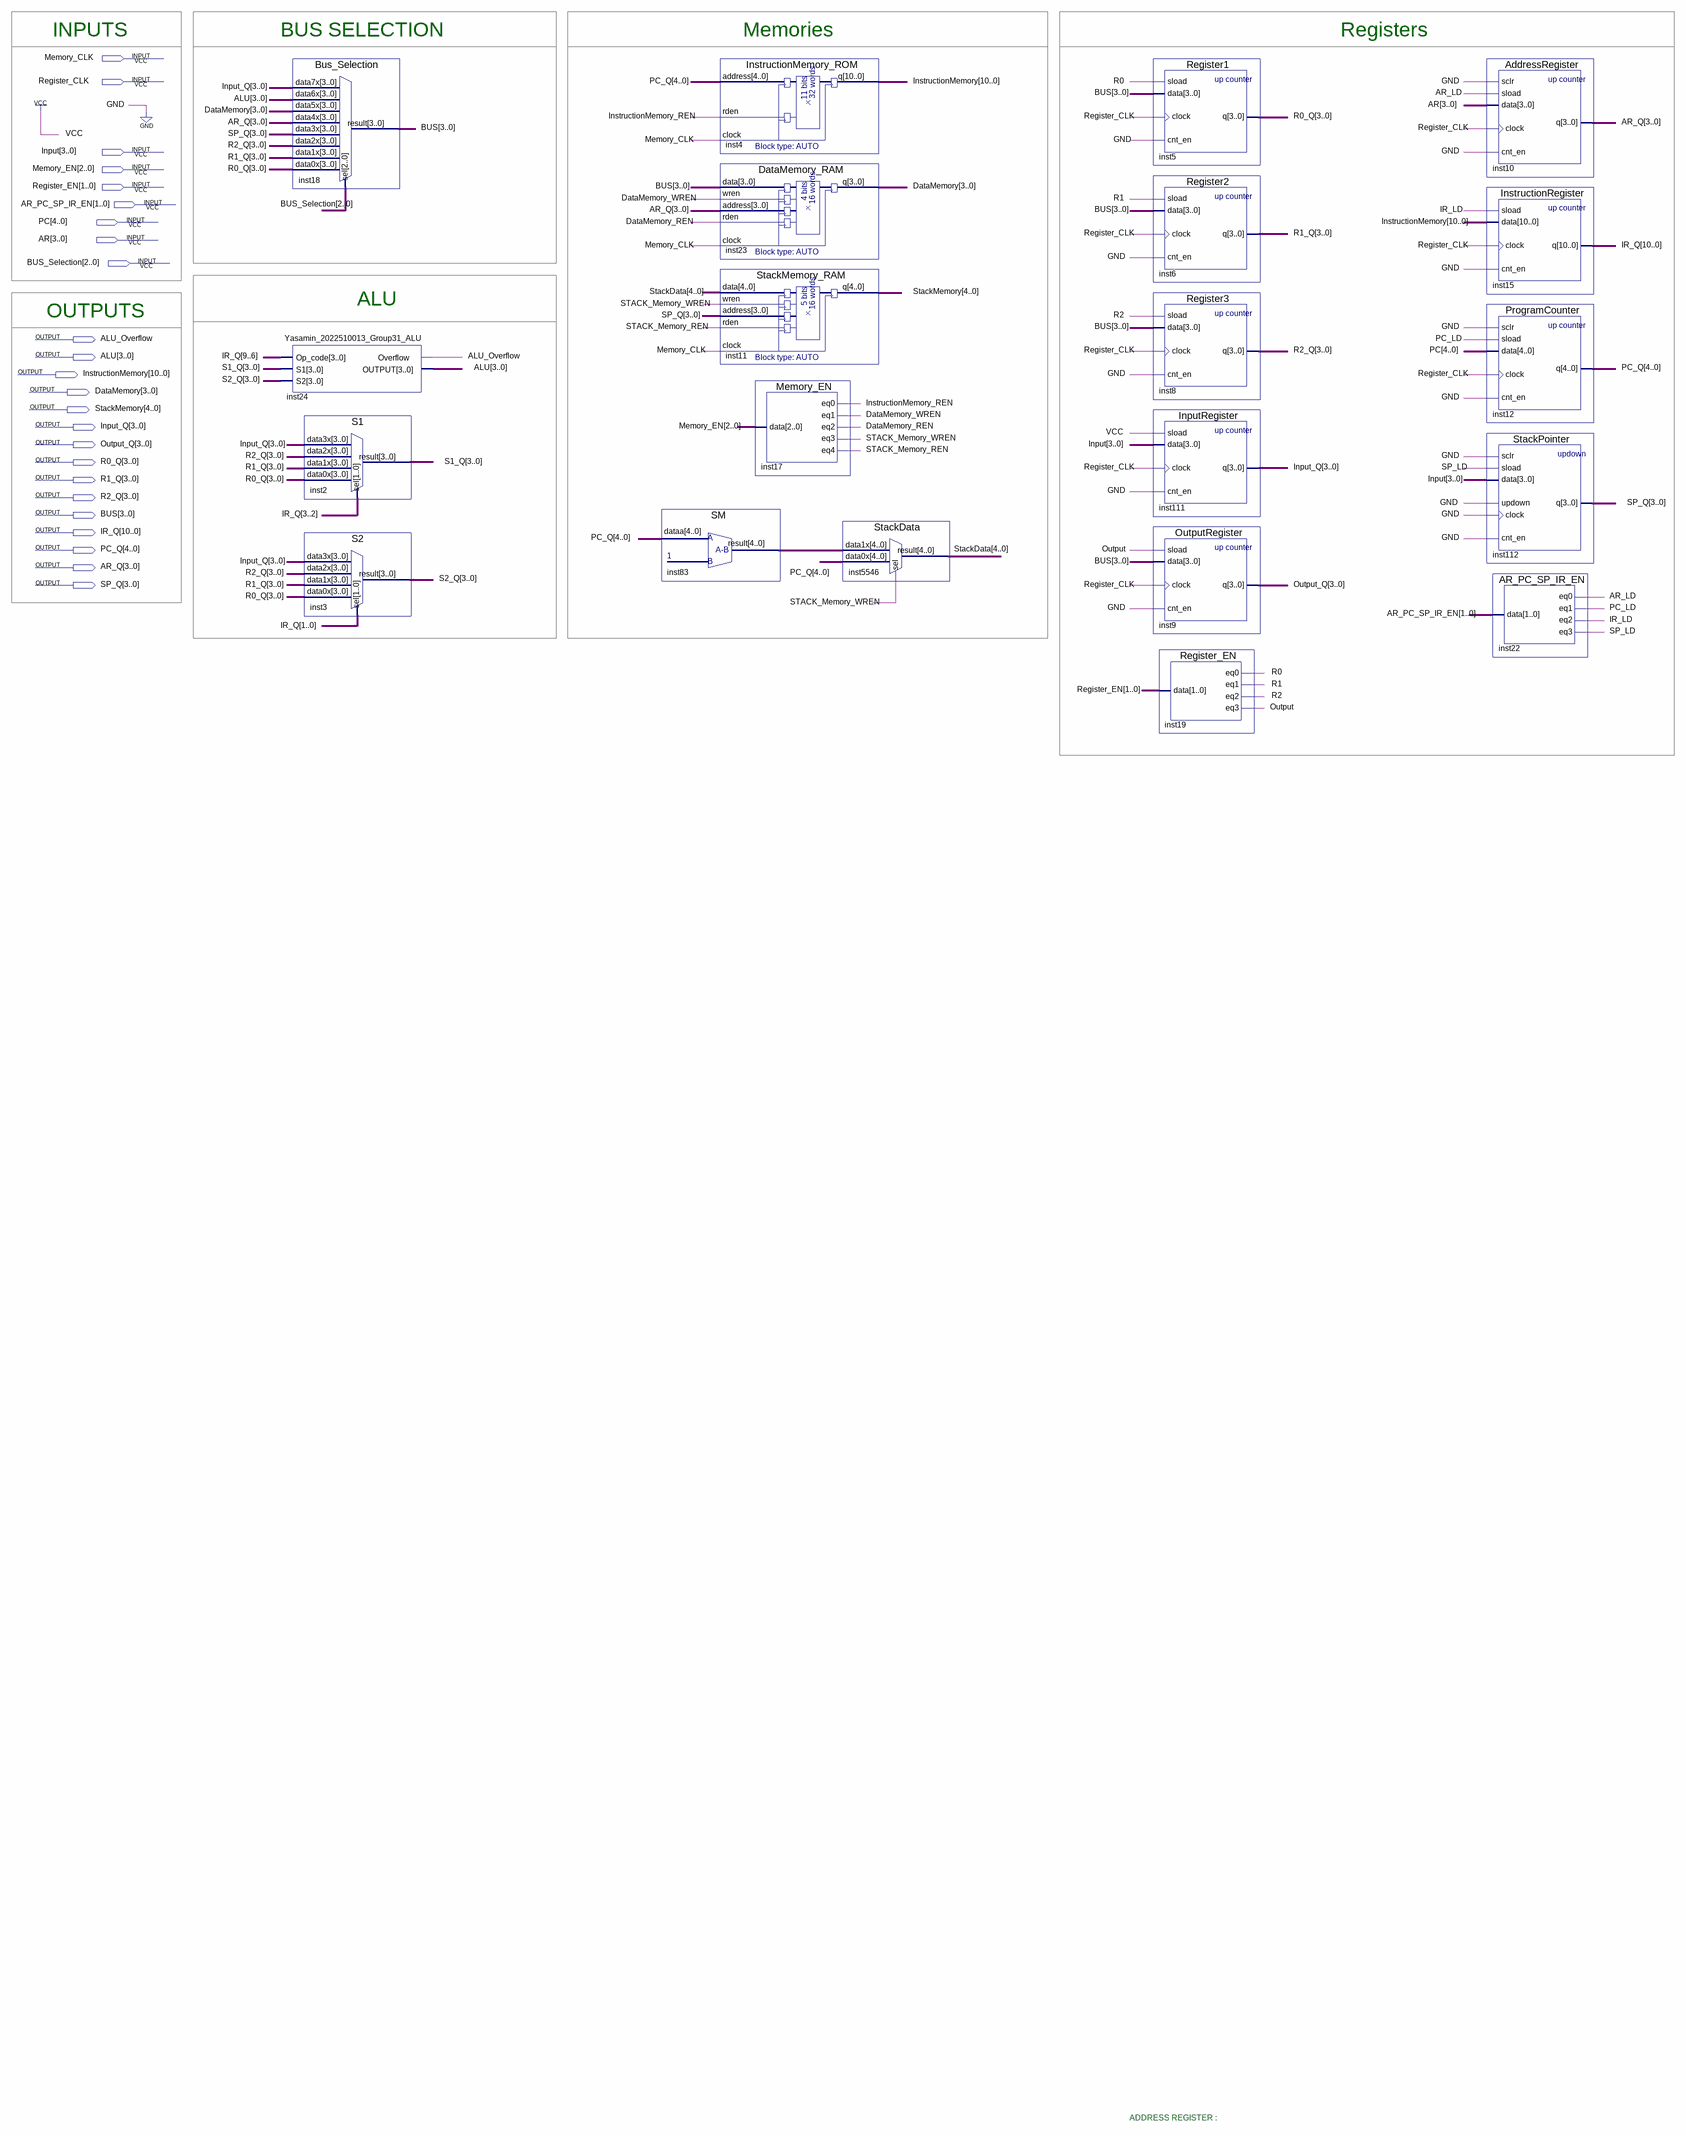
[diagram p0: schematic sheet]
// Quartus schematic Kasra_2022510011_Group31_BUS.bdf as structural Verilog: 21 symbols, 24 pins
module Kasra_2022510011_Group31_BUS (
  input  Memory_CLK,
  input  Register_CLK,
  input  [3:0] Input,
  input  [2:0] Memory_EN,
  input  [1:0] Register_EN,
  input  [1:0] AR_PC_SP_IR_EN,
  input  [4:0] PC,
  input  [3:0] AR,
  input  [2:0] BUS_Selection,
  output ALU_Overflow,
  output [3:0] ALU,
  output [10:0] InstructionMemory,
  output [3:0] DataMemory,
  output [4:0] StackMemory,
  output [3:0] Input_Q,
  output [3:0] Output_Q,
  output [3:0] R0_Q,
  output [3:0] R1_Q,
  output [3:0] R2_Q,
  output [3:0] BUS,
  output [10:0] IR_Q,
  output [4:0] PC_Q,
  output [3:0] AR_Q,
  output [3:0] SP_Q
);

  wire AR_LD, DataMemory_REN, DataMemory_WREN, InstructionMemory_REN, IR_LD, Output, PC_LD, R0, R1, R2,
       SP_LD, STACK_Memory_REN, STACK_Memory_WREN;
  wire [3:0] S1_Q, S2_Q;
  wire [4:0] inst83_result, StackData;

  Bus_Selection inst18 (
    .data7x(Input_Q), .data6x(ALU), .data5x(DataMemory), .data4x(AR_Q), .data3x(SP_Q), .data2x(R2_Q),
    .data1x(R1_Q), .data0x(R0_Q), .sel(BUS_Selection), .result(BUS));
  Yasamin_2022510013_Group31_ALU inst24 (
    .Op_code(IR_Q[9:6]), .S1(S1_Q), .S2(S2_Q), .Overflow(ALU_Overflow), .OUTPUT(ALU));
  S1 inst2 (.data3x(Input_Q), .data2x(R2_Q), .data1x(R1_Q), .data0x(R0_Q), .sel(IR_Q[3:2]), .result(S1_Q));
  S2 inst3 (.data3x(Input_Q), .data2x(R2_Q), .data1x(R1_Q), .data0x(R0_Q), .sel(IR_Q[1:0]), .result(S2_Q));
  SM inst83 (.dataa(PC_Q), .result(inst83_result));
  InstructionMemory_ROM inst4 (.address(PC_Q), .rden(InstructionMemory_REN), .clock(Memory_CLK), .q(InstructionMemory));
  DataMemory_RAM inst23 (
    .data(BUS), .wren(DataMemory_WREN), .address(AR_Q), .rden(DataMemory_REN), .clock(Memory_CLK),
    .q(DataMemory));
  StackMemory_RAM inst11 (
    .data(StackData), .wren(STACK_Memory_WREN), .address(SP_Q), .rden(STACK_Memory_REN), .clock(Memory_CLK),
    .q(StackMemory));
  Memory_EN inst17 (
    .data(Memory_EN), .eq0(InstructionMemory_REN), .eq1(DataMemory_WREN), .eq2(DataMemory_REN),
    .eq3(STACK_Memory_WREN), .eq4(STACK_Memory_REN));
  StackData inst5546 (.data1x(inst83_result), .data0x(PC_Q), .sel(STACK_Memory_WREN), .result(StackData));
  Register1 inst5 (.sload(R0), .data(BUS), .clock(Register_CLK), .cnt_en(1'b0), .q(R0_Q));
  Register2 inst6 (.sload(R1), .data(BUS), .clock(Register_CLK), .cnt_en(1'b0), .q(R1_Q));
  Register3 inst8 (.sload(R2), .data(BUS), .clock(Register_CLK), .cnt_en(1'b0), .q(R2_Q));
  InputRegister inst111 (.sload(1'b1), .data(Input), .clock(Register_CLK), .cnt_en(1'b0), .q(Input_Q));
  OutputRegister inst9 (.sload(Output), .data(BUS), .clock(Register_CLK), .cnt_en(1'b0), .q(Output_Q));
  Register_EN inst19 (.data(Register_EN), .eq0(R0), .eq1(R1), .eq2(R2), .eq3(Output));
  AddressRegister inst10 (.sclr(1'b0), .sload(AR_LD), .data(AR), .clock(Register_CLK), .cnt_en(1'b0), .q(AR_Q));
  InstructionRegister inst15 (.sload(IR_LD), .data(InstructionMemory), .clock(Register_CLK), .cnt_en(1'b0), .q(IR_Q));
  ProgramCounter inst12 (.sclr(1'b0), .sload(PC_LD), .data(PC), .clock(Register_CLK), .cnt_en(1'b0), .q(PC_Q));
  StackPointer inst112 (.sclr(1'b0), .sload(SP_LD), .data(Input), .updown(1'b0), .clock(1'b0), .cnt_en(1'b0), .q(SP_Q));
  AR_PC_SP_IR_EN inst22 (.data(AR_PC_SP_IR_EN), .eq0(AR_LD), .eq1(PC_LD), .eq2(IR_LD), .eq3(SP_LD));

  // Notes on the sheet:
  //   INPUTS
  //   BUS SELECTION
  //   Memories
  //   Registers
  //   ALU
  //   OUTPUTS
  //   ADDRESS REGISTER :  
endmodule
